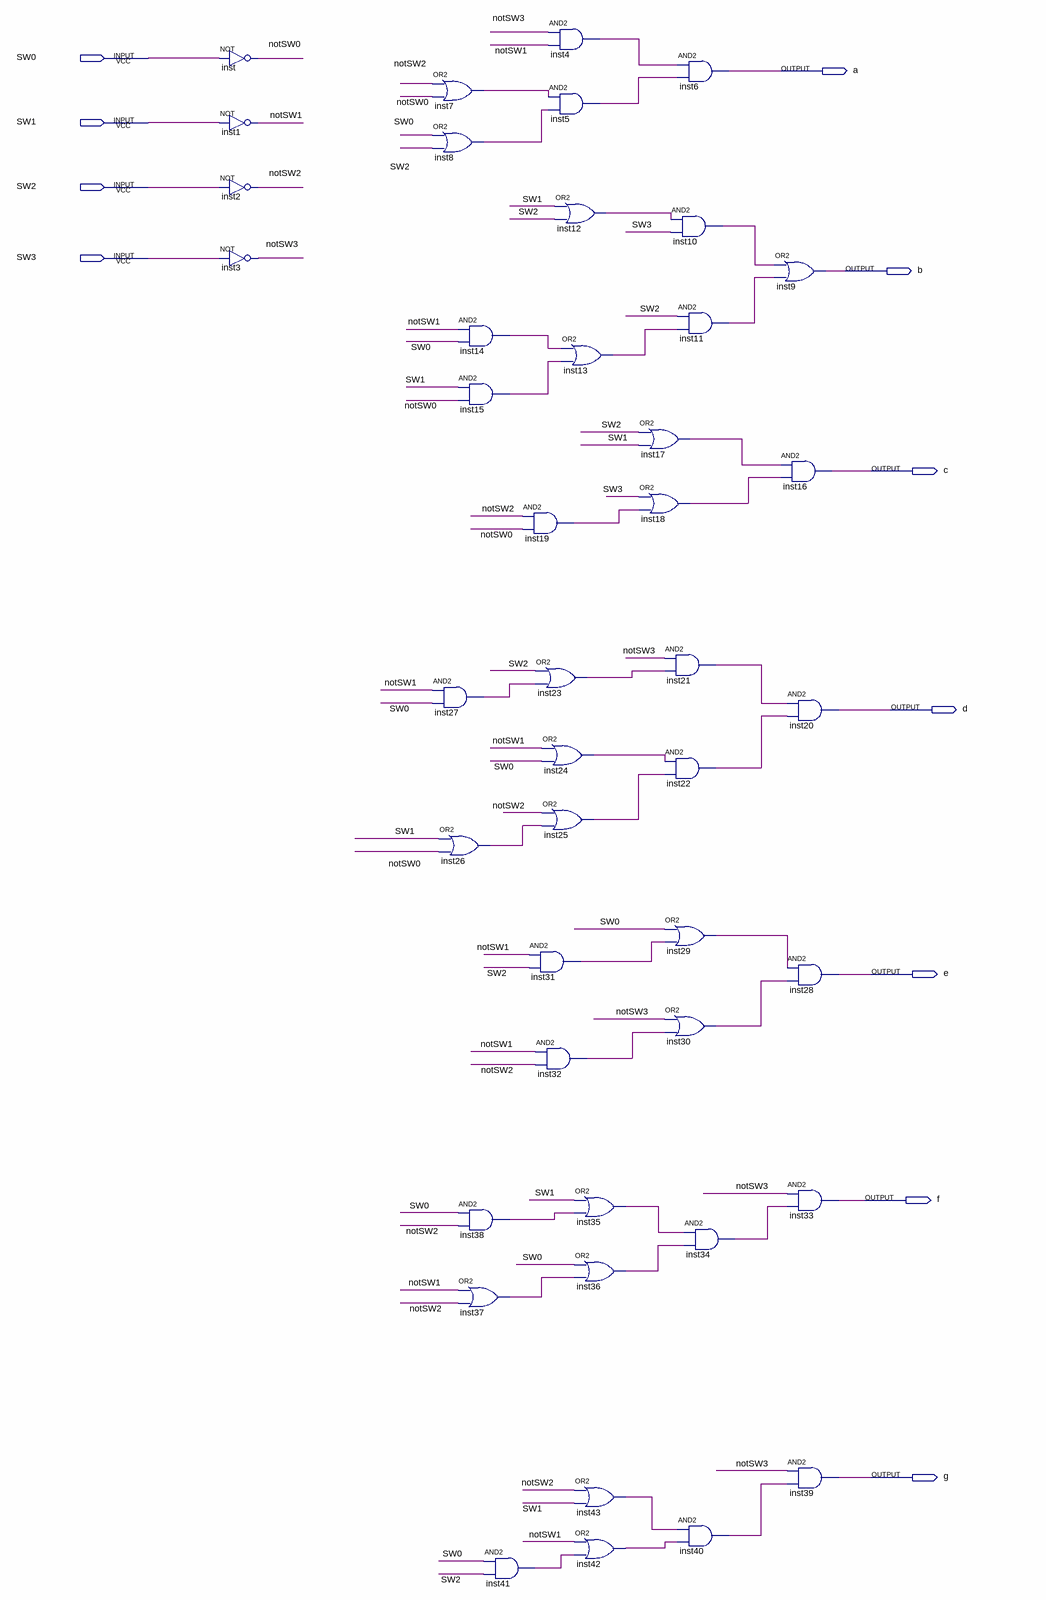
[diagram p0: schematic sheet]
// Quartus schematic DOMACI1.bdf as structural Verilog: 44 symbols, 11 pins
module DOMACI1 (
  input  SW0,
  input  SW1,
  input  SW2,
  input  SW3,
  output a,
  output b,
  output c,
  output d,
  output e,
  output f,
  output g
);

  wire inst4_out, inst5_out, inst7_out, inst8_out, inst10_out, inst11_out, inst12_out, inst13_out,
       inst14_out, inst15_out, inst17_out, inst18_out, inst19_out, inst21_out, inst22_out, inst23_out,
       inst24_out, inst25_out, inst26_out, inst27_out, inst29_out, inst30_out, inst31_out, inst32_out,
       inst34_out, inst35_out, inst36_out, inst37_out, inst38_out, inst40_out, inst41_out, inst42_out,
       inst43_out, notSW0, notSW1, notSW2, notSW3;

  not inst (notSW0, SW0);
  not inst1 (notSW1, SW1);
  not inst2 (notSW2, SW2);
  not inst3 (notSW3, SW3);
  or inst7 (inst7_out, notSW2, notSW0);
  or inst8 (inst8_out, SW0, SW2);
  and inst14 (inst14_out, notSW1, SW0);
  and inst15 (inst15_out, SW1, notSW0);
  and inst27 (inst27_out, notSW1, SW0);
  or inst26 (inst26_out, SW1, notSW0);
  and inst38 (inst38_out, SW0, notSW2);
  or inst37 (inst37_out, notSW1, notSW2);
  and inst41 (inst41_out, SW0, SW2);
  and inst4 (inst4_out, notSW3, notSW1);
  and inst5 (inst5_out, inst7_out, inst8_out);
  or inst12 (inst12_out, SW1, SW2);
  or inst13 (inst13_out, inst14_out, inst15_out);
  and inst19 (inst19_out, notSW2, notSW0);
  or inst23 (inst23_out, SW2, inst27_out);
  or inst24 (inst24_out, notSW1, SW0);
  or inst25 (inst25_out, notSW2, inst26_out);
  and inst31 (inst31_out, notSW1, SW2);
  and inst32 (inst32_out, notSW1, notSW2);
  or inst35 (inst35_out, SW1, inst38_out);
  or inst36 (inst36_out, SW0, inst37_out);
  or inst43 (inst43_out, notSW2, SW1);
  or inst42 (inst42_out, notSW1, inst41_out);
  or inst17 (inst17_out, SW2, SW1);
  or inst18 (inst18_out, SW3, inst19_out);
  and inst21 (inst21_out, notSW3, inst23_out);
  and inst22 (inst22_out, inst24_out, inst25_out);
  or inst29 (inst29_out, SW0, inst31_out);
  or inst30 (inst30_out, notSW3, inst32_out);
  and inst6 (a, inst4_out, inst5_out);
  and inst10 (inst10_out, inst12_out, SW3);
  and inst11 (inst11_out, SW2, inst13_out);
  and inst34 (inst34_out, inst35_out, inst36_out);
  and inst40 (inst40_out, inst43_out, inst42_out);
  or inst9 (b, inst10_out, inst11_out);
  and inst16 (c, inst17_out, inst18_out);
  and inst20 (d, inst21_out, inst22_out);
  and inst28 (e, inst29_out, inst30_out);
  and inst33 (f, notSW3, inst34_out);
  and inst39 (g, notSW3, inst40_out);
endmodule
